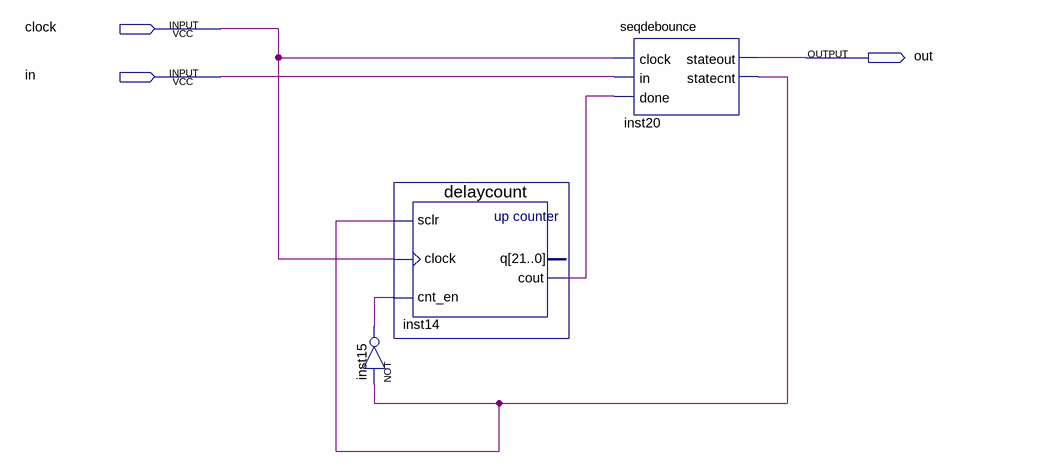
[diagram p0: schematic sheet]
// Quartus schematic debouncer.bdf as structural Verilog: 3 symbols, 3 pins
module debouncer (
  input  clock,
  input  in,
  output out
);

  wire inst14_cout, inst15_out, inst20_statecnt;

  not inst15 (inst15_out, inst20_statecnt);
  delaycount inst14 (.sclr(inst20_statecnt), .clock(clock), .cnt_en(inst15_out), .cout(inst14_cout));  // open: q
  seqdebounce inst20 (.clock(clock), .in(in), .done(inst14_cout), .stateout(out), .statecnt(inst20_statecnt));
endmodule
